# Altium schematic sheet MSP432.SchDoc
size Letter
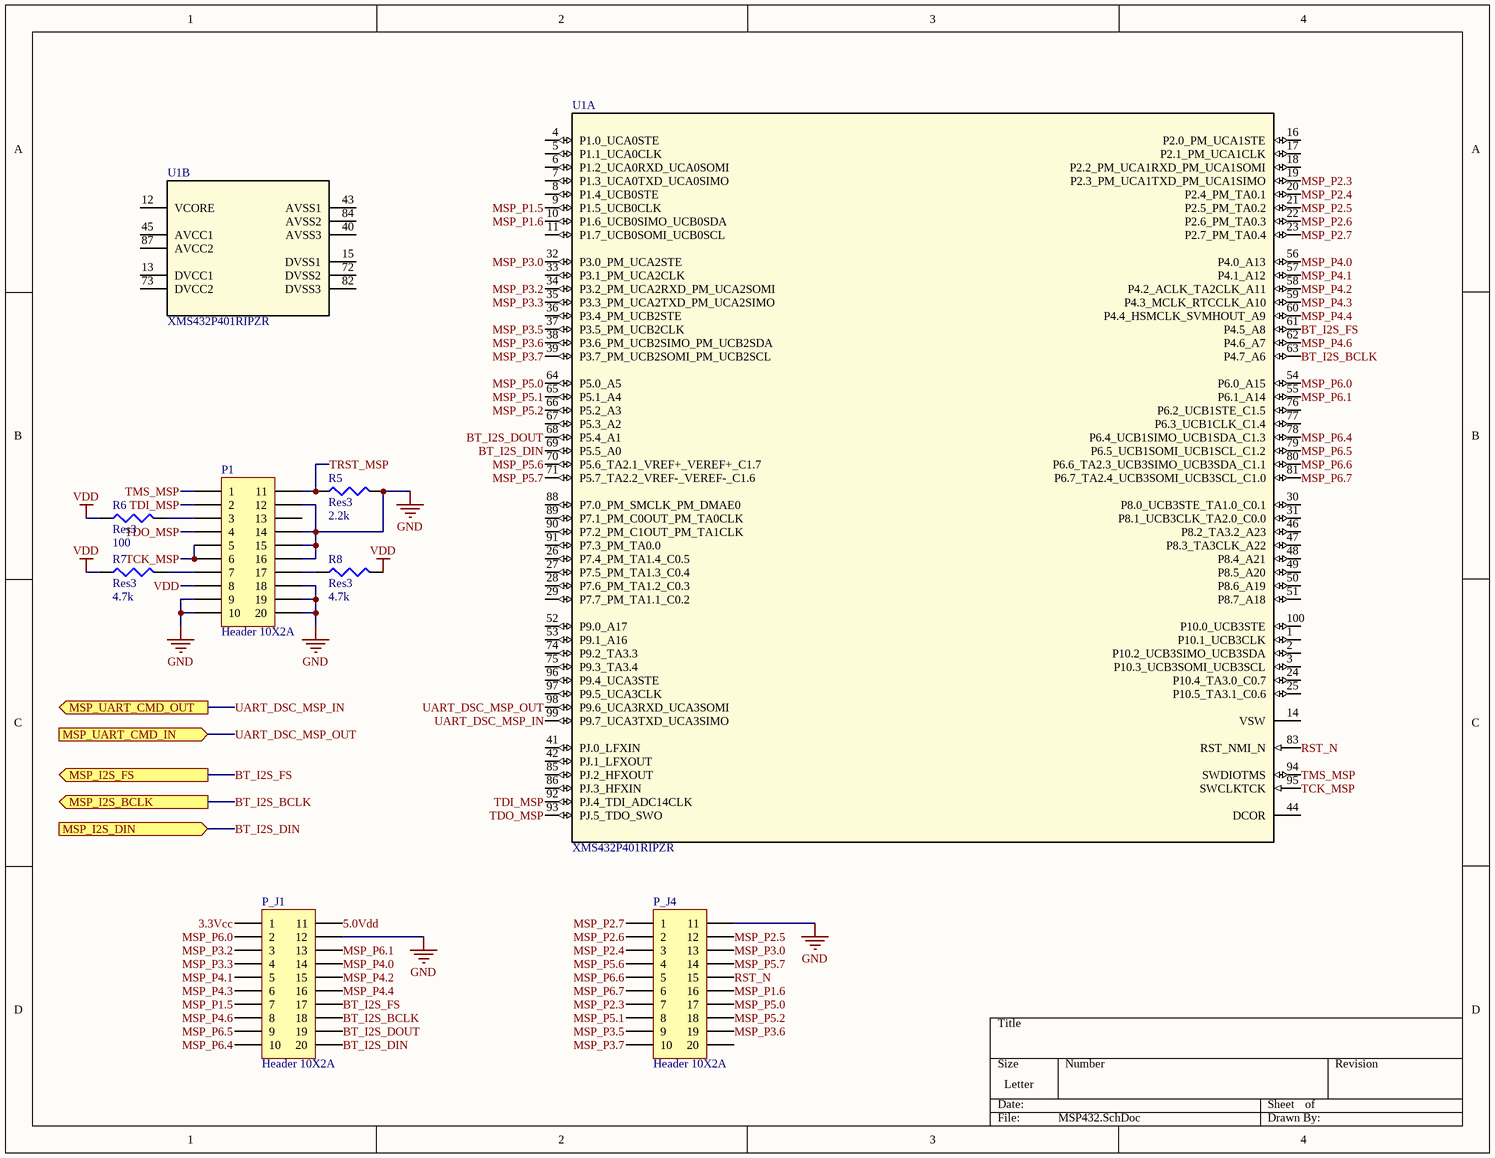
[diagram p0: MSP432.SchDoc]

## Parts
P1  Header 10X2A  [HDR2X10_CEN]
P_J1  Header 10X2A  [HDR2X10_CEN]
P_J4  Header 10X2A  [HDR2X10_CEN]
R5  Res3  value 2.2k  [J1-0603]
R6  Res3  value 100  [J1-0603]
R7  Res3  value 4.7k  [J1-0603]
R8  Res3  value 4.7k  [J1-0603]
U1  XMS432P401RIPZR  [PZ0100A_N]  (parts A,B of 2)

## Ports
MSP_I2S_BCLK (out), MSP_I2S_DIN (in), MSP_I2S_FS (out), MSP_UART_CMD_IN (in), MSP_UART_CMD_OUT (out)

## Nets
GND: P1.9 P1.10 P1.12 P1.14 P1.15 P1.16 P1.18 P1.19 P1.20 P_J1.12 P_J4.11 R5.2
VDD: P1.8 R6.1 R7.1 R8.2
3.3Vcc: P_J1.1
5.0Vdd: P_J1.11
BT_I2S_BCLK: P_J1.18 U1.63(P4.7_A6) ; port MSP_I2S_BCLK
BT_I2S_DIN: P_J1.20 U1.69(P5.5_A0) ; port MSP_I2S_DIN
BT_I2S_DOUT: P_J1.19 U1.68(P5.4_A1)
BT_I2S_FS: P_J1.17 U1.61(P4.5_A8) ; port MSP_I2S_FS
MSP_P1.5: P_J1.7 U1.9(P1.5_UCB0CLK)
MSP_P1.6: P_J4.16 U1.10(P1.6_UCB0SIMO_UCB0SDA)
MSP_P2.3: P_J4.7 U1.19(P2.3_PM_UCA1TXD_PM_UCA1SIMO)
MSP_P2.4: P_J4.3 U1.20(P2.4_PM_TA0.1)
MSP_P2.5: P_J4.12 U1.21(P2.5_PM_TA0.2)
MSP_P2.6: P_J4.2 U1.22(P2.6_PM_TA0.3)
MSP_P2.7: P_J4.1 U1.23(P2.7_PM_TA0.4)
MSP_P3.0: P_J4.13 U1.32(P3.0_PM_UCA2STE)
MSP_P3.2: P_J1.3 U1.34(P3.2_PM_UCA2RXD_PM_UCA2SOMI)
MSP_P3.3: P_J1.4 U1.35(P3.3_PM_UCA2TXD_PM_UCA2SIMO)
MSP_P3.5: P_J4.9 U1.37(P3.5_PM_UCB2CLK)
MSP_P3.6: P_J4.19 U1.38(P3.6_PM_UCB2SIMO_PM_UCB2SDA)
MSP_P3.7: P_J4.10 U1.39(P3.7_PM_UCB2SOMI_PM_UCB2SCL)
MSP_P4.0: P_J1.14 U1.56(P4.0_A13)
MSP_P4.1: P_J1.5 U1.57(P4.1_A12)
MSP_P4.2: P_J1.15 U1.58(P4.2_ACLK_TA2CLK_A11)
MSP_P4.3: P_J1.6 U1.59(P4.3_MCLK_RTCCLK_A10)
MSP_P4.4: P_J1.16 U1.60(P4.4_HSMCLK_SVMHOUT_A9)
MSP_P4.6: P_J1.8 U1.62(P4.6_A7)
MSP_P5.0: P_J4.17 U1.64(P5.0_A5)
MSP_P5.1: P_J4.8 U1.65(P5.1_A4)
MSP_P5.2: P_J4.18 U1.66(P5.2_A3)
MSP_P5.6: P_J4.4 U1.70(P5.6_TA2.1_VREF+_VEREF+_C1.7)
MSP_P5.7: P_J4.14 U1.71(P5.7_TA2.2_VREF-_VEREF-_C1.6)
MSP_P6.0: P_J1.2 U1.54(P6.0_A15)
MSP_P6.1: P_J1.13 U1.55(P6.1_A14)
MSP_P6.4: P_J1.10 U1.78(P6.4_UCB1SIMO_UCB1SDA_C1.3)
MSP_P6.5: P_J1.9 U1.79(P6.5_UCB1SOMI_UCB1SCL_C1.2)
MSP_P6.6: P_J4.5 U1.80(P6.6_TA2.3_UCB3SIMO_UCB3SDA_C1.1)
MSP_P6.7: P_J4.6 U1.81(P6.7_TA2.4_UCB3SOMI_UCB3SCL_C1.0)
RST_N: P_J4.15 U1.83(RST_NMI_N)
TCK_MSP: P1.5 P1.6 U1.95(SWCLKTCK)
TDI_MSP: P1.2 U1.92(PJ.4_TDI_ADC14CLK)
TDO_MSP: P1.4 U1.93(PJ.5_TDO_SWO)
TMS_MSP: P1.1 U1.94(SWDIOTMS)
TRST_MSP: P1.11 R5.1
UART_DSC_MSP_IN: U1.99(P9.7_UCA3TXD_UCA3SIMO) ; port MSP_UART_CMD_OUT
UART_DSC_MSP_OUT: U1.98(P9.6_UCA3RXD_UCA3SOMI) ; port MSP_UART_CMD_IN
NetP1_3: P1.3 R6.2
NetP1_7: P1.7 R7.2
NetP1_17: P1.17 R8.1

Not connected (* = marked no-connect by the designer): P1 13; P_J4 20; U1 1(P10.1_UCB3CLK) 2(P10.2_UCB3SIMO_UCB3SDA) 3(P10.3_UCB3SOMI_UCB3SCL) 4(P1.0_UCA0STE) 5(P1.1_UCA0CLK) 6(P1.2_UCA0RXD_UCA0SOMI) 7(P1.3_UCA0TXD_UCA0SIMO) 8(P1.4_UCB0STE) 11(P1.7_UCB0SOMI_UCB0SCL) 12(VCORE) 13(DVCC1) 14(VSW) 15(DVSS1) 16(P2.0_PM_UCA1STE) 17(P2.1_PM_UCA1CLK) 18(P2.2_PM_UCA1RXD_PM_UCA1SOMI) 24(P10.4_TA3.0_C0.7) 25(P10.5_TA3.1_C0.6) 26(P7.4_PM_TA1.4_C0.5) 27(P7.5_PM_TA1.3_C0.4) 28(P7.6_PM_TA1.2_C0.3) 29(P7.7_PM_TA1.1_C0.2) 30(P8.0_UCB3STE_TA1.0_C0.1) 31(P8.1_UCB3CLK_TA2.0_C0.0) 33(P3.1_PM_UCA2CLK) 36(P3.4_PM_UCB2STE) 40(AVSS3) 41(PJ.0_LFXIN) 42(PJ.1_LFXOUT) 43(AVSS1) 44(DCOR) 45(AVCC1) 46(P8.2_TA3.2_A23) 47(P8.3_TA3CLK_A22) 48(P8.4_A21) 49(P8.5_A20) 50(P8.6_A19) 51(P8.7_A18) 52(P9.0_A17) 53(P9.1_A16) 67(P5.3_A2) 72(DVSS2) 73(DVCC2) 74(P9.2_TA3.3) 75(P9.3_TA3.4) 76(P6.2_UCB1STE_C1.5) 77(P6.3_UCB1CLK_C1.4) 82(DVSS3) 84(AVSS2) 85(PJ.2_HFXOUT) 86(PJ.3_HFXIN) 87(AVCC2) 88(P7.0_PM_SMCLK_PM_DMAE0) 89(P7.1_PM_C0OUT_PM_TA0CLK) 90(P7.2_PM_C1OUT_PM_TA1CLK) 91(P7.3_PM_TA0.0) 96(P9.4_UCA3STE) 97(P9.5_UCA3CLK) 100(P10.0_UCB3STE)

## Library data of the parts
P1 P_J1 P_J4 = Header 10X2A: Header, 10-Pin, Dual row; LatestRevisionDate: 17-Jul-2002; LatestRevisionNote: Re-released for DXP Platform.; Publisher: Altium Limited
R5-R8 = Res3: Resistor; Published: 8-Jun-2000; LatestRevisionDate: 29-May-2009; LatestRevisionNote: IPC-7351 Footprint Added.; PackageReference: J1-0603; Publisher: Altium Limited; PackageDescription: Chip Resistor
U1 = XMS432P401RIPZR: Imported; Manufacturer: Texas Instruments; CompType: IC; PIN_COUNT: 100; PartNumber: XMS432P401RIPZR; PackageReference: PZ0100A; MountType: SMT; RefDes: RefDes; TYPE: TYPE; Value: Value